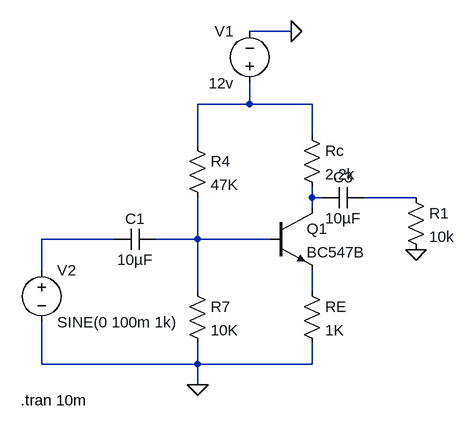
[diagram p0: schematic Common-emitter.asc]
Common-emitter.asc, the LTspice schematic file:
Version 4.1
SHEET 1 880 680
WIRE 288 -208 224 -208
WIRE 224 -96 224 -128
WIRE 224 -96 144 -96
WIRE 320 -96 224 -96
WIRE 320 -48 320 -96
WIRE 144 -32 144 -96
WIRE 320 48 320 32
WIRE 336 48 320 48
WIRE 480 48 400 48
WIRE 320 64 320 48
WIRE 16 112 -96 112
WIRE 144 112 144 48
WIRE 144 112 80 112
WIRE 256 112 144 112
WIRE -96 160 -96 112
WIRE 144 192 144 112
WIRE 320 192 320 160
WIRE -96 304 -96 240
WIRE 144 304 144 272
WIRE 144 304 -96 304
WIRE 320 304 320 272
WIRE 320 304 144 304
WIRE 144 336 144 304
FLAG 288 -208 0
FLAG 144 336 0
FLAG 480 128 0
SYMBOL res 304 176 R0
SYMATTR InstName RE
SYMATTR Value 1K
SYMBOL res 128 -48 R0
SYMATTR InstName R4
SYMATTR Value 47K
SYMBOL res 304 -64 R0
SYMATTR InstName Rc
SYMATTR Value 2.2k
SYMBOL cap 80 96 R90
WINDOW 0 0 32 VBottom 2
WINDOW 3 32 32 VTop 2
SYMATTR InstName C1
SYMATTR Value 10µF
SYMBOL npn 256 64 R0
SYMATTR InstName Q1
SYMATTR Value BC547B
SYMBOL res 128 176 R0
SYMATTR InstName R7
SYMATTR Value 10K
SYMBOL voltage 224 -112 R180
WINDOW 0 24 96 Left 2
WINDOW 3 24 16 Left 2
SYMATTR InstName V1
SYMATTR Value 12v
SYMBOL cap 400 32 R90
WINDOW 0 0 32 VBottom 2
WINDOW 3 32 32 VTop 2
SYMATTR InstName C3
SYMATTR Value 10µF
SYMBOL voltage -96 144 R0
WINDOW 123 0 0 Left 0
WINDOW 39 0 0 Left 0
SYMATTR InstName V2
SYMATTR Value SINE(0 100m 1k)
SYMBOL res 464 32 R0
SYMATTR InstName R1
SYMATTR Value 10k
TEXT -128 360 Left 2 !.tran 10m

The netlist it stands for:
* Common-emitter.asc
RE N006 0 1K
R4 N001 N005 47K
Rc N001 N002 2.2k
C1 N005 N004 10µF
Q1 N002 N005 N006 0 BC547B
R7 N005 0 10K
V1 N001 0 12v
C3 N003 N002 10µF
V2 N004 0 SINE(0 100m 1k)
R1 N003 0 10k
.model NPN NPN
.model PNP PNP
.lib standard.bjt
.tran 10m
.backanno
.end